# Altium project PracticalElectronics_Waleed_Umer.PrjPcb
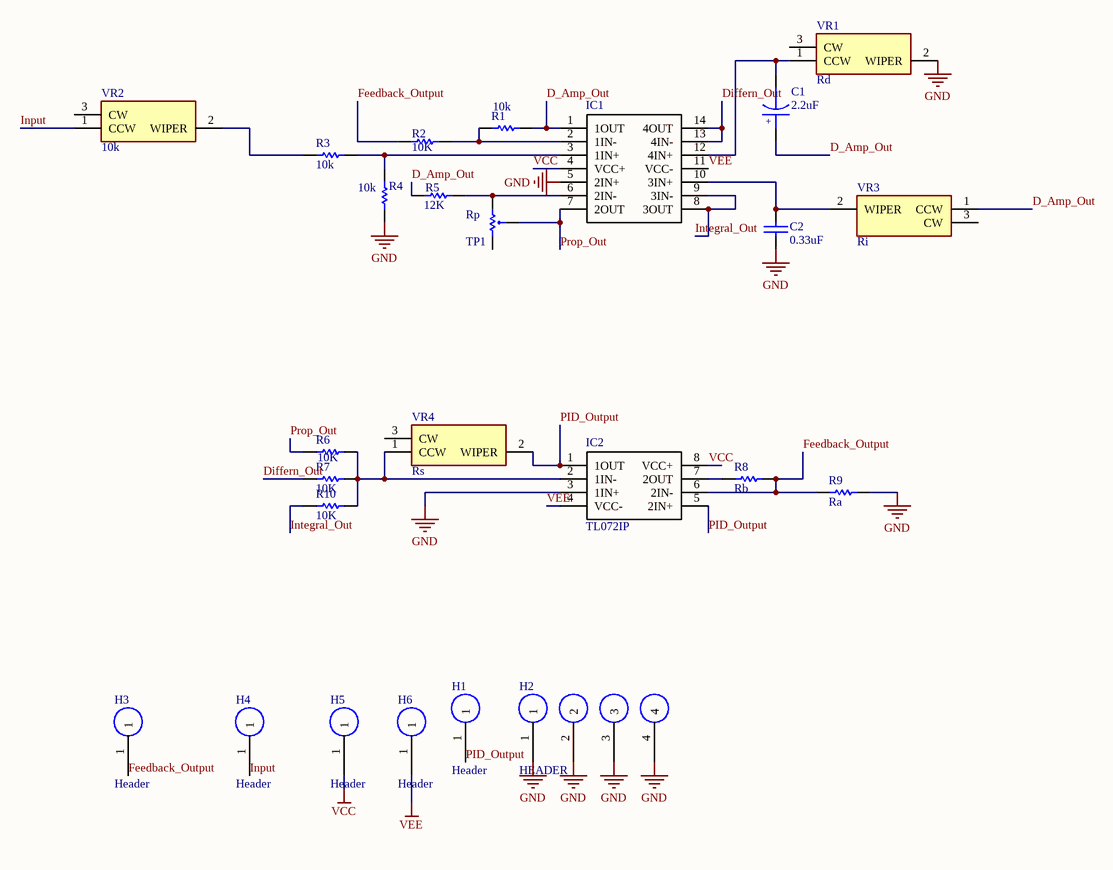
[diagram p0: Sheet1.SchDoc]
1 sheet, 25 parts. Net scope: global (net labels, ports and power ports of the same name join across sheets).
Board file: PCB1.PcbDoc

## Sheet Sheet1.SchDoc
size A4; SheetNumber: 1; SheetTotal: 1

### Parts
C1  2.2uF  [RB.1/.2]
C2  0.33uF  [RAD0.1]
H1  Header  [HEADER SINGLE]
H2  HEADER  [HEADER QUAD]
H3  Header  [HEADER SINGLE]
H4  Header  [HEADER SINGLE]
H5  Header  [HEADER SINGLE]
H6  Header  [HEADER SINGLE]
IC1  (no value)  [DIP794W53P254L1930H508Q14N]
IC2  TL072IP  [DIP794W53P254L959H508Q8N]
R1  10k  [AXIAL0.4]
R2  10K  [AXIAL0.4]
R3  10k  [AXIAL0.4]
R4  10k  [AXIAL0.4]
R5  12K  [AXIAL0.4]
R6  10K  [AXIAL0.4]
R7  10K  [AXIAL0.4]
R8  Rb  [AXIAL0.4]
R9  Ra  [AXIAL0.4]
R10  10K  [AXIAL0.4]
TP1  Rp  [TRIMPOT]
VR1  Rd  [3386F1104TLF]
VR2  10k  [3386F1104TLF]
VR3  Ri  [3386F1104TLF]
VR4  Rs  [3386F1104TLF]

### Nets
GND: C2.1 H2.1 H2.2 H2.3 H2.4 IC1.5(2IN+) IC2.3(1IN+) R4.1 R9.2 VR1.2(WIPER)
VCC: H5.1 IC1.4(VCC+) IC2.8(VCC+)
VEE: H6.1 IC1.11(VCC-) IC2.4(VCC-)
D_Amp_Out: C1.1 IC1.1(1OUT) R1.2 R5.1 VR3.1(CCW)
Differn_Out: IC1.13(4IN-) IC1.14(4OUT) R7.1
Feedback_Output : H3.1 IC2.6(2IN-) R2.1 R8.2 R9.1
Input: H4.1 VR2.1(CCW)
Integral_Out: IC1.8(3OUT) IC1.9(3IN-) R10.1
PID_Output: H1.1 IC2.1(1OUT) IC2.5(2IN+) VR4.2(WIPER)
Prop_Out: IC1.7(2OUT) R6.1 TP1.2
NetC1_2: C1.2 IC1.12(4IN+) VR1.1(CCW)
NetC2_2: C2.2 IC1.10(3IN+) VR3.2(WIPER)
NetIC1_2: IC1.2(1IN-) R1.1 R2.2
NetIC1_3: IC1.3(1IN+) R3.2 R4.2
NetIC1_6: IC1.6(2IN-) R5.2 TP1.1
NetIC2_2: IC2.2(1IN-) R6.2 R7.2 R10.2 VR4.1(CCW)
NetIC2_7: IC2.7(2OUT) R8.1
NetR3_1: R3.1 VR2.2(WIPER)

Not connected (* = marked no-connect by the designer): TP1 3; VR1 3(CW); VR2 3(CW); VR3 3(CW); VR4 3(CW)

### Notes on the sheet
- (in symbol CAPACITOR POL) +

### Library data of the parts
C1 = CAPACITOR POL: Polarized Cap; Function: *; Voltage: *; Amps: *; Watts: *; %: *; Man No: *; Supplier: *; Supplier No: *; Cost: *; Break: *; MOQ: *; Note: *; Alternative: *
C2 = CAP: Non Polarized Cap; Function: *; Voltage: *; Amps: *; Watts: *; %: *; Man No: *; Supplier: *; Supplier No: *; Cost: *; Break: *; MOQ: *; Note: *; Alternative: *
H1 H3-H6 = HEADER 1: Header single
H2 = HEADER 4: Header quad
IC1 = TL074CN: Integrated Circuit; Manufacturer_Name: TEXAS; Datasheet Link: https://www.ti.com/lit/ds/symlink/tl071h.pdf?HQS=dis-mous-null-mousermode-dsf-pf-null-wwe; Height: 5.08mm; Manufacturer_Part_Number: TL074CN; Mouser Part Number: 511-TL074CN; Mouser Price/Stock: https://www.mouser.co.uk/ProductDetail/STMicroelectronics/TL074CN?qs=46HR8ipXVSu5lerO3SL9VA%3D%3D
IC2 = TL072IP: Integrated Circuit; Manufacturer_Name: Texas Instruments; Datasheet Link: http://www.ti.com/lit/ds/symlink/tl071a.pdf; Height: 5.08mm; Manufacturer_Part_Number: TL072IP; Mouser Part Number: 595-TL072IP; Mouser Price/Stock: https://www.mouser.co.uk/ProductDetail/Texas-Instruments/TL072IP?qs=5BZzbFV4k2v7IBrcArRPQw%3D%3D; Arrow Part Number: TL072IP; Arrow Price/Stock: https://www.arrow.com/en/products/tl072ip/texas-instruments
R1-R10 = RES: 1/4 W Res; Function: *; Voltage: *; Amps: *; Watts: *; %: *; Man No: *; Supplier: *; Supplier No: *; Cost: *; Break: *; MOQ: *; Notes: *; Alternative: *
TP1 = TRIMPOT: Rp=250K
VR1-VR4 = 3386F-1-104TLF: Variable Resistor; Manufacturer_Name: Bourns; Datasheet Link: https://www.bourns.com/docs/Product-Datasheets/3386.pdf; Height: 5.08mm; Manufacturer_Part_Number: 3386F-1-104TLF; Mouser Part Number: 652-3386F-1-104TLF; Mouser Price/Stock: https://www.mouser.co.uk/ProductDetail/Bourns/3386F-1-104TLF?qs=jh2Y1wKDsmjfFzCYrNL%2FAQ%3D%3D; Arrow Part Number: 3386F-1-104TLF; Arrow Price/Stock: https://www.arrow.com/en/products/3386f-1-104tlf/bourns?region=nac